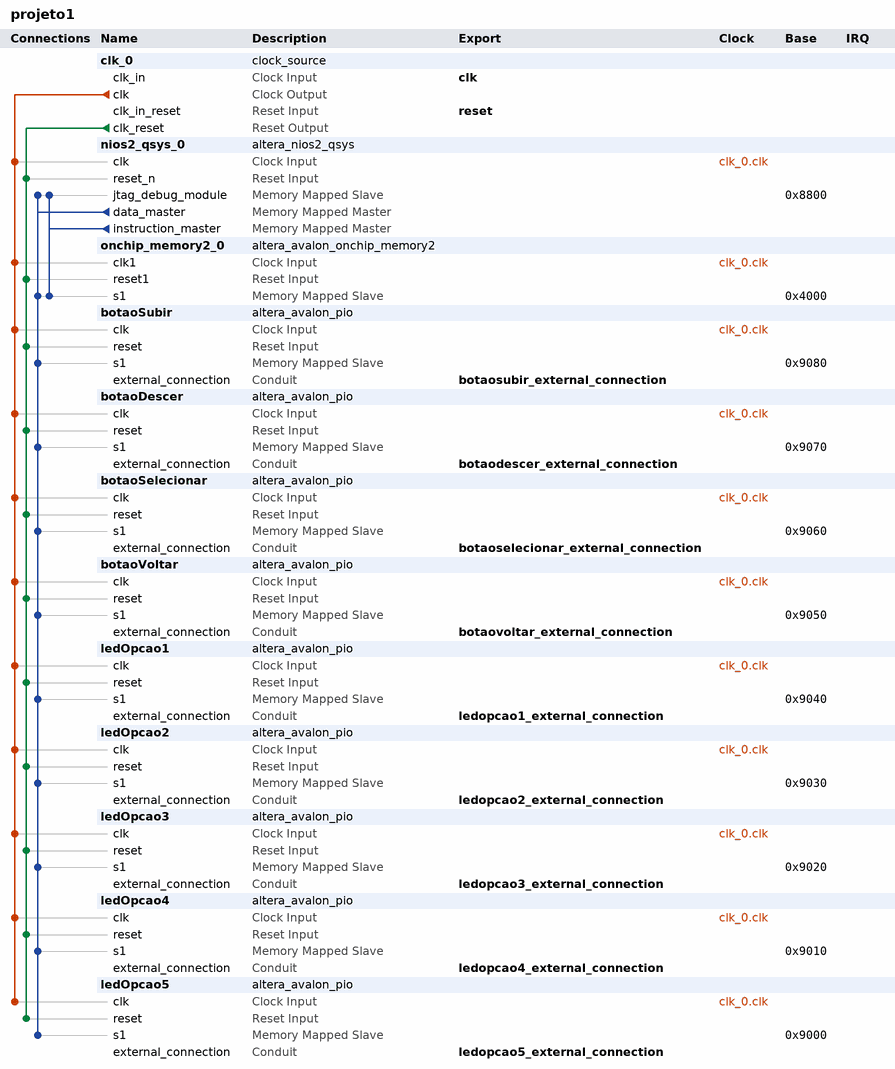
[diagram p0: system contents]
# Platform Designer (Qsys) system projeto1, Cyclone III EP3C25F324C6
# Parameters at their usual value, and those the tool derives, are not listed.
package require -exact qsys 13.1
create_system projeto1
set_project_property DEVICE_FAMILY {Cyclone III}
set_project_property DEVICE EP3C25F324C6

add_instance clk_0 clock_source 13.1
set_instance_parameter_value clk_0 clockFrequency 50000000

add_instance nios2_qsys_0 altera_nios2_qsys 13.1
set_instance_parameter_value nios2_qsys_0 resetSlave onchip_memory2_0.s1
set_instance_parameter_value nios2_qsys_0 mmu_TLBMissExcSlave None
set_instance_parameter_value nios2_qsys_0 exceptionSlave onchip_memory2_0.s1
set_instance_parameter_value nios2_qsys_0 breakSlave nios2_qsys_0.jtag_debug_module
set_instance_parameter_value nios2_qsys_0 impl Tiny
set_instance_parameter_value nios2_qsys_0 icache_size 4096

add_instance onchip_memory2_0 altera_avalon_onchip_memory2 13.1
set_instance_parameter_value onchip_memory2_0 dataWidth 32
set_instance_parameter_value onchip_memory2_0 dualPort false
set_instance_parameter_value onchip_memory2_0 initMemContent true
set_instance_parameter_value onchip_memory2_0 initializationFileName onchip_mem.hex
set_instance_parameter_value onchip_memory2_0 memorySize 16372

add_instance botaoSubir altera_avalon_pio 13.1
set_instance_parameter_value botaoSubir direction Input
set_instance_parameter_value botaoSubir width 1

add_instance botaoDescer altera_avalon_pio 13.1
set_instance_parameter_value botaoDescer direction Input
set_instance_parameter_value botaoDescer width 1

add_instance botaoSelecionar altera_avalon_pio 13.1
set_instance_parameter_value botaoSelecionar direction Input
set_instance_parameter_value botaoSelecionar width 1

add_instance botaoVoltar altera_avalon_pio 13.1
set_instance_parameter_value botaoVoltar direction Input
set_instance_parameter_value botaoVoltar width 1

add_instance ledOpcao1 altera_avalon_pio 13.1
set_instance_parameter_value ledOpcao1 direction Output
set_instance_parameter_value ledOpcao1 width 1

add_instance ledOpcao2 altera_avalon_pio 13.1
set_instance_parameter_value ledOpcao2 direction Output
set_instance_parameter_value ledOpcao2 width 1

add_instance ledOpcao3 altera_avalon_pio 13.1
set_instance_parameter_value ledOpcao3 direction Output
set_instance_parameter_value ledOpcao3 width 1

add_instance ledOpcao4 altera_avalon_pio 13.1
set_instance_parameter_value ledOpcao4 direction Output
set_instance_parameter_value ledOpcao4 width 1

add_instance ledOpcao5 altera_avalon_pio 13.1
set_instance_parameter_value ledOpcao5 direction Output
set_instance_parameter_value ledOpcao5 width 1

# connections
add_connection clk_0.clk botaoDescer.clk clock
add_connection clk_0.clk botaoSelecionar.clk clock
add_connection clk_0.clk botaoSubir.clk clock
add_connection clk_0.clk botaoVoltar.clk clock
add_connection clk_0.clk ledOpcao1.clk clock
add_connection clk_0.clk ledOpcao2.clk clock
add_connection clk_0.clk ledOpcao3.clk clock
add_connection clk_0.clk ledOpcao4.clk clock
add_connection clk_0.clk ledOpcao5.clk clock
add_connection clk_0.clk nios2_qsys_0.clk clock
add_connection clk_0.clk onchip_memory2_0.clk1 clock
add_connection clk_0.clk_reset botaoDescer.reset reset
add_connection clk_0.clk_reset botaoSelecionar.reset reset
add_connection clk_0.clk_reset botaoSubir.reset reset
add_connection clk_0.clk_reset botaoVoltar.reset reset
add_connection clk_0.clk_reset ledOpcao1.reset reset
add_connection clk_0.clk_reset ledOpcao2.reset reset
add_connection clk_0.clk_reset ledOpcao3.reset reset
add_connection clk_0.clk_reset ledOpcao4.reset reset
add_connection clk_0.clk_reset ledOpcao5.reset reset
add_connection clk_0.clk_reset nios2_qsys_0.reset_n reset
add_connection clk_0.clk_reset onchip_memory2_0.reset1 reset
add_connection nios2_qsys_0.data_master botaoDescer.s1 avalon
set_connection_parameter_value nios2_qsys_0.data_master/botaoDescer.s1 baseAddress 0x9070
add_connection nios2_qsys_0.data_master botaoSelecionar.s1 avalon
set_connection_parameter_value nios2_qsys_0.data_master/botaoSelecionar.s1 baseAddress 0x9060
add_connection nios2_qsys_0.data_master botaoSubir.s1 avalon
set_connection_parameter_value nios2_qsys_0.data_master/botaoSubir.s1 baseAddress 0x9080
add_connection nios2_qsys_0.data_master botaoVoltar.s1 avalon
set_connection_parameter_value nios2_qsys_0.data_master/botaoVoltar.s1 baseAddress 0x9050
add_connection nios2_qsys_0.data_master ledOpcao1.s1 avalon
set_connection_parameter_value nios2_qsys_0.data_master/ledOpcao1.s1 baseAddress 0x9040
add_connection nios2_qsys_0.data_master ledOpcao2.s1 avalon
set_connection_parameter_value nios2_qsys_0.data_master/ledOpcao2.s1 baseAddress 0x9030
add_connection nios2_qsys_0.data_master ledOpcao3.s1 avalon
set_connection_parameter_value nios2_qsys_0.data_master/ledOpcao3.s1 baseAddress 0x9020
add_connection nios2_qsys_0.data_master ledOpcao4.s1 avalon
set_connection_parameter_value nios2_qsys_0.data_master/ledOpcao4.s1 baseAddress 0x9010
add_connection nios2_qsys_0.data_master ledOpcao5.s1 avalon
set_connection_parameter_value nios2_qsys_0.data_master/ledOpcao5.s1 baseAddress 0x9000
add_connection nios2_qsys_0.data_master nios2_qsys_0.jtag_debug_module avalon
set_connection_parameter_value nios2_qsys_0.data_master/nios2_qsys_0.jtag_debug_module baseAddress 0x8800
add_connection nios2_qsys_0.data_master onchip_memory2_0.s1 avalon
set_connection_parameter_value nios2_qsys_0.data_master/onchip_memory2_0.s1 baseAddress 0x4000
add_connection nios2_qsys_0.instruction_master nios2_qsys_0.jtag_debug_module avalon
set_connection_parameter_value nios2_qsys_0.instruction_master/nios2_qsys_0.jtag_debug_module baseAddress 0x8800
add_connection nios2_qsys_0.instruction_master onchip_memory2_0.s1 avalon
set_connection_parameter_value nios2_qsys_0.instruction_master/onchip_memory2_0.s1 baseAddress 0x4000

# exported interfaces
add_interface clk clock sink
set_interface_property clk EXPORT_OF clk_0.clk_in
add_interface reset reset sink
set_interface_property reset EXPORT_OF clk_0.clk_in_reset
add_interface botaosubir_external_connection conduit end
set_interface_property botaosubir_external_connection EXPORT_OF botaoSubir.external_connection
add_interface botaodescer_external_connection conduit end
set_interface_property botaodescer_external_connection EXPORT_OF botaoDescer.external_connection
add_interface botaoselecionar_external_connection conduit end
set_interface_property botaoselecionar_external_connection EXPORT_OF botaoSelecionar.external_connection
add_interface botaovoltar_external_connection conduit end
set_interface_property botaovoltar_external_connection EXPORT_OF botaoVoltar.external_connection
add_interface ledopcao1_external_connection conduit end
set_interface_property ledopcao1_external_connection EXPORT_OF ledOpcao1.external_connection
add_interface ledopcao2_external_connection conduit end
set_interface_property ledopcao2_external_connection EXPORT_OF ledOpcao2.external_connection
add_interface ledopcao3_external_connection conduit end
set_interface_property ledopcao3_external_connection EXPORT_OF ledOpcao3.external_connection
add_interface ledopcao4_external_connection conduit end
set_interface_property ledopcao4_external_connection EXPORT_OF ledOpcao4.external_connection
add_interface ledopcao5_external_connection conduit end
set_interface_property ledopcao5_external_connection EXPORT_OF ledOpcao5.external_connection

set_interconnect_requirement {$system} qsys_mm.clockCrossingAdapter HANDSHAKE
set_interconnect_requirement {$system} qsys_mm.maxAdditionalLatency 1
set_interconnect_requirement {$system} qsys_mm.insertDefaultSlave false

save_system projeto1.qsys
